# Altium project ETRX_Shield.PrjPcb (part 1 of 2)
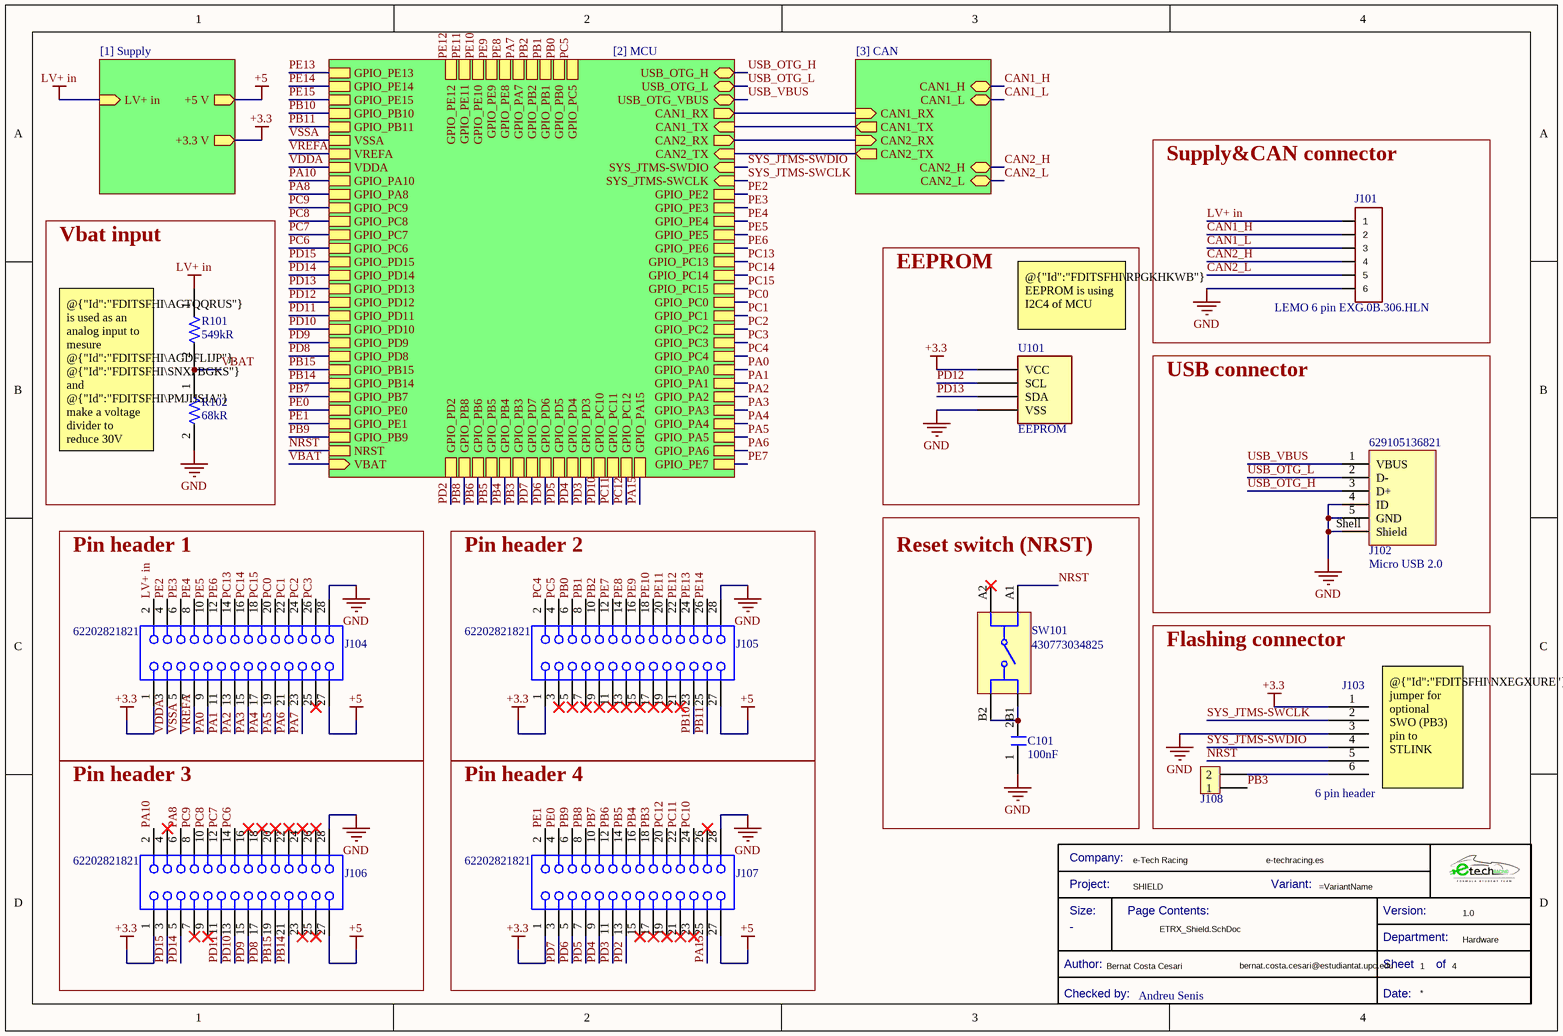
[diagram p0: ETRX_Shield.SchDoc]
Company: e-Tech Racing; Department: Hardware; DesignedByURL: e-techracing.es; DesignerMail: bernat.costa.cesari@estudiantat.upc.edu; DesignerName: Bernat Costa Cesari; Project: SHIELD; ReviewerName: Andreu Senis; Version: 1.0
4 sheets, 61 parts. Net scope: hierarchical (ports join the sheet entries above them; power ports are global).
Sheets:
  ETRX_Shield.SchDoc
    [1] Supply = [1] Supply.SchDoc
    [2] MCU = [2] MCU.SchDoc
    [3] CAN = [3] CAN.SchDoc

## Sheet ETRX_Shield.SchDoc
size A4; DocumentNumber: 1; SheetNumber: 1; SheetTotal: 4

### Parts
*  Checked by:: Andreu Senis  (hidden comment: Title Block_template)  (graphical)
C101  Capacitance: 100nF  [C1206FNPC-RW]  (hidden comment: 885012208058)
J101  LEMO 6 pin EXG.0B.306.HLN  [EXG.0B.306.HLN]
J102  629105136821  [629105136821]
J103  6 pin header
J104  62202821821  [62202821821]
J105  62202821821  [62202821821]
J106  62202821821  [62202821821]
J107  62202821821  [62202821821]
J108  282836-2  [J_screw_1x2]  (value not drawn)
R101  549kR
R102  Resistance: 68kR  [R1206FTK-W]  (hidden comment: CR1206AFX-6802EAS)
SW101  430773034825  [WS-TASV_L6W6H3.4_4307x30348xx]
U101  EEPROM

### Blocks framed on the sheet
Supply&CAN connector: J101
Vbat input: R101 R102
EEPROM: U101
USB connector: J102
Reset switch (NRST): C101 SW101
Pin header 1: J104
Pin header 2: J105
Flashing connector: J103 J108
Pin header 3: J106
Pin header 4: J107

### Sub-sheets
[1] Supply = [1] Supply: LV+ in (in), +5 V (out), +3.3 V (out)
[2] MCU = [2] MCU: CAN1_RX (out), CAN1_TX (in), CAN2_RX (out), CAN2_TX (in), USB_OTG_H (bidir), USB_OTG_L (bidir), SYS_JTMS-SWDIO (in), SYS_JTMS-SWCLK (in), GPIO_PE2, GPIO_PE3, GPIO_PE4, GPIO_PE5, GPIO_PC13, GPIO_PC14, GPIO_PC15, GPIO_PC0, GPIO_PC1, GPIO_PC2, GPIO_PC3, GPIO_PA0, GPIO_PA1, GPIO_PA2, GPIO_PA3, GPIO_PA4, GPIO_PA5, GPIO_PC4, GPIO_PC5, GPIO_PB0, GPIO_PB1, GPIO_PB2, GPIO_PE8, GPIO_PE9, GPIO_PE10, GPIO_PE11, GPIO_PE12, GPIO_PE13, GPIO_PE14, GPIO_PE15, GPIO_PB10, GPIO_PB11, VSSA, VREFA, VDDA, GPIO_PA8, GPIO_PC9, GPIO_PC8, GPIO_PC7, GPIO_PC6, GPIO_PD15, GPIO_PD14, GPIO_PD13, GPIO_PD12, GPIO_PD11, GPIO_PD10, GPIO_PD9, GPIO_PD8, GPIO_PB15, GPIO_PB14, USB_OTG_VBUS (bidir), GPIO_PB7, GPIO_PE1, GPIO_PE0, GPIO_PB9, GPIO_PB8, GPIO_PB6, GPIO_PB5, GPIO_PB4, GPIO_PB3, GPIO_PD7, GPIO_PD6, GPIO_PD5, GPIO_PD4, GPIO_PD3, GPIO_PD2, GPIO_PC12, GPIO_PC11, GPIO_PC10, GPIO_PA15, GPIO_PA10, GPIO_PE6, GPIO_PA6, GPIO_PA7, GPIO_PE7, NRST, VBAT (in)
[3] CAN = [3] CAN: CAN1_H (bidir), CAN1_L (bidir), CAN2_H (bidir), CAN2_L (bidir), CAN1_RX (in), CAN2_RX (in), CAN1_TX (out), CAN2_TX (out)

### Nets
+3.3: J103.1 J104.1 J105.1 J106.1 J107.1 U101.1(VCC) ; sheet [1] Supply/+3.3 V
+5: J104.27 J105.27 J106.27 J107.27 ; sheet [1] Supply/+5 V
GND: C101.1 J101.6 J102.4(ID) J102.5(GND) J102.Shell(Shield) J103.3 J104.28 J105.28 J106.28 J107.28 R102.2 U101.4(VSS)
LV+ in: J101.1 J104.2 R101.1 ; sheet [1] Supply/LV+ in
CAN1_H: J101.2 ; sheet [3] CAN/CAN1_H
CAN1_L: J101.3 ; sheet [3] CAN/CAN1_L
CAN1_RX: sheet [2] MCU/CAN1_RX, sheet [3] CAN/CAN1_RX
CAN1_TX: sheet [2] MCU/CAN1_TX, sheet [3] CAN/CAN1_TX
CAN2_H: J101.4 ; sheet [3] CAN/CAN2_H
CAN2_L: J101.5 ; sheet [3] CAN/CAN2_L
CAN2_RX: sheet [2] MCU/CAN2_RX, sheet [3] CAN/CAN2_RX
CAN2_TX: sheet [2] MCU/CAN2_TX, sheet [3] CAN/CAN2_TX
NRST: J103.5 SW101.A1 ; sheet [2] MCU/NRST
PA0: J104.9 ; sheet [2] MCU/GPIO_PA0
PA1: J104.11 ; sheet [2] MCU/GPIO_PA1
PA2: J104.13 ; sheet [2] MCU/GPIO_PA2
PA3: J104.15 ; sheet [2] MCU/GPIO_PA3
PA4: J104.17 ; sheet [2] MCU/GPIO_PA4
PA5: J104.19 ; sheet [2] MCU/GPIO_PA5
PA6: J104.21 ; sheet [2] MCU/GPIO_PA6
PA7: J104.23 ; sheet [2] MCU/GPIO_PA7
PA8: J106.6 ; sheet [2] MCU/GPIO_PA8
PA10: J106.2 ; sheet [2] MCU/GPIO_PA10
PA15: J107.25 ; sheet [2] MCU/GPIO_PA15
PB0: J105.6 ; sheet [2] MCU/GPIO_PB0
PB1: J105.8 ; sheet [2] MCU/GPIO_PB1
PB2: J105.10 ; sheet [2] MCU/GPIO_PB2
PB3: J107.18 J108.1 ; sheet [2] MCU/GPIO_PB3
PB4: J107.16 ; sheet [2] MCU/GPIO_PB4
PB5: J107.14 ; sheet [2] MCU/GPIO_PB5
PB6: J107.12 ; sheet [2] MCU/GPIO_PB6
PB7: J107.10 ; sheet [2] MCU/GPIO_PB7
PB8: J107.8 ; sheet [2] MCU/GPIO_PB8
PB9: J107.6 ; sheet [2] MCU/GPIO_PB9
PB10: J105.23 ; sheet [2] MCU/GPIO_PB10
PB11: J105.25 ; sheet [2] MCU/GPIO_PB11
PB14: J106.21 ; sheet [2] MCU/GPIO_PB14
PB15: J106.19 ; sheet [2] MCU/GPIO_PB15
PC0: J104.20 ; sheet [2] MCU/GPIO_PC0
PC1: J104.22 ; sheet [2] MCU/GPIO_PC1
PC2: J104.24 ; sheet [2] MCU/GPIO_PC2
PC3: J104.26 ; sheet [2] MCU/GPIO_PC3
PC4: J105.2 ; sheet [2] MCU/GPIO_PC4
PC5: J105.4 ; sheet [2] MCU/GPIO_PC5
PC6: J106.14 ; sheet [2] MCU/GPIO_PC6
PC7: J106.12 ; sheet [2] MCU/GPIO_PC7
PC8: J106.10 ; sheet [2] MCU/GPIO_PC8
PC9: J106.8 ; sheet [2] MCU/GPIO_PC9
PC10: J107.24
PC11: J107.22 ; sheet [2] MCU/GPIO_PC11
PC12: J107.20 ; sheet [2] MCU/GPIO_PC12
PC13: J104.14 ; sheet [2] MCU/GPIO_PC13
PC14: J104.16 ; sheet [2] MCU/GPIO_PC14
PC15: J104.18 ; sheet [2] MCU/GPIO_PC15
PD2: J107.13 ; sheet [2] MCU/GPIO_PD2
PD3: J107.11 ; sheet [2] MCU/GPIO_PD3
PD4: J107.9 ; sheet [2] MCU/GPIO_PD4
PD5: J107.7 ; sheet [2] MCU/GPIO_PD5
PD6: J107.5 ; sheet [2] MCU/GPIO_PD6
PD7: J107.3 ; sheet [2] MCU/GPIO_PD7
PD8: J106.17 ; sheet [2] MCU/GPIO_PD8
PD9: J106.15 ; sheet [2] MCU/GPIO_PD9
PD10: J106.13 ; sheet [2] MCU/GPIO_PD10, sheet [2] MCU/GPIO_PC10
PD11: J106.11 ; sheet [2] MCU/GPIO_PD11
PD12: U101.2(SCL) ; sheet [2] MCU/GPIO_PD12
PD13: U101.3(SDA) ; sheet [2] MCU/GPIO_PD13
PD14: J106.5 ; sheet [2] MCU/GPIO_PD14
PD15: J106.3 ; sheet [2] MCU/GPIO_PD15
PE0: J107.4 ; sheet [2] MCU/GPIO_PE0
PE1: J107.2 ; sheet [2] MCU/GPIO_PE1
PE2: J104.4 ; sheet [2] MCU/GPIO_PE2
PE3: J104.6 ; sheet [2] MCU/GPIO_PE3
PE4: J104.8 ; sheet [2] MCU/GPIO_PE4
PE5: J104.10 ; sheet [2] MCU/GPIO_PE5
PE6: J104.12 ; sheet [2] MCU/GPIO_PE6
PE7: J105.12 ; sheet [2] MCU/GPIO_PE7
PE8: J105.14 ; sheet [2] MCU/GPIO_PE8
PE9: J105.16 ; sheet [2] MCU/GPIO_PE9
PE10: J105.18 ; sheet [2] MCU/GPIO_PE10
PE11: J105.20 ; sheet [2] MCU/GPIO_PE11
PE12: J105.22 ; sheet [2] MCU/GPIO_PE12
PE13: J105.24 ; sheet [2] MCU/GPIO_PE13
PE14: J105.26 ; sheet [2] MCU/GPIO_PE14
SYS_JTMS-SWCLK: J103.2 ; sheet [2] MCU/SYS_JTMS-SWCLK
SYS_JTMS-SWDIO: J103.4 ; sheet [2] MCU/SYS_JTMS-SWDIO
USB_OTG_H: J102.3(D+) ; sheet [2] MCU/USB_OTG_H
USB_OTG_L: J102.2(D-) ; sheet [2] MCU/USB_OTG_L
USB_VBUS: J102.1(VBUS) ; sheet [2] MCU/USB_OTG_VBUS
VBAT: R101.2 R102.1 ; sheet [2] MCU/VBAT
VDDA: J104.3 ; sheet [2] MCU/VDDA
VREFA: J104.7 ; sheet [2] MCU/VREFA
VSSA: J104.5 ; sheet [2] MCU/VSSA
NetC101_2: C101.2 SW101.B1 SW101.B2
NetJ103_6: J103.6 J108.2

Not connected (* = marked no-connect by the designer): J104 25*; J105 3* 5* 7* 9* 11* 13* 15* 17* 19* 21*; J106 4* 7* 9* 16* 18* 20* 22* 23* 24* 25* 26*; J107 15* 17* 19* 21* 23* 26*; SW101 A2*

### Notes on the sheet
- (near U101) @{"Id":"FDITSFHI\RPGKHKWB"} EEPROM is using I2C4 of MCU
- @{"Id":"FDITSFHI\AGTQQRUS"} is used as an analog input to mesure @{"Id":"FDITSFHI\AGDFLIJP"}. @{"Id":"FDITSFHI\SNXPBGKS"} and @{"Id":"FDITSFHI\PMJIJSJA"} make a voltage divider to reduce 30V from @{"Id":"FDITSFHI\AGDFLIJP"} to 3.3V
- (near J102) Micro USB 2.0
- (near J103) @{"Id":"FDITSFHI\NXEGXURE"} jumper for optional SWO (PB3) pin to STLINK
- (in symbol Title Block_template) Company:; Project:; Variant:; Size:; Page Contents:; Version:; Department:; Author:; Sheet; of; Checked by:; Date:

### Library data of the parts
* = Title Block_template: Standard Title Block; .Creator: GP; Category: Title Block; .PCBcheck: GP; .SCHcheck: GP; Size: -
C101 = C100n-25V-1206FNPC-X7R: Cap Cer 0.1UF 25V X7R 1206; Manufacturer: Wurth Electronics; Tolerance: 10%; .Creator: DO; Category: Capacitor; ComponentLink1Description: Datasheet; ComponentLink1URL: https://www.we-online.com/catalog/datasheet/885012208058.pdf; ComponentLink2Description: Where buy it; ComponentLink2URL: https://www.we-online.com/catalog/en/WCAP-CSGP-25VDC#885012208058; Supplier 1: Digi-Key; Manufacturer Part Number: 885012208058; RoHS: Yes; Stock 1: 4375; Pricing 1: 1=0,11000, 10=0,10100, 100=0,09100, 500=0,08000 (USD); Mount: Surface Mount; Case/Package: 1206; Case Code (Metric): 3216; Case Code (Imperial): 1206; Min Operating Temperature: -55°C; Max Operating Temperature: 125°C; Packaging: Tape and Reel; Voltage Rating: 25V; Length: 0.126inch; Width: 0.063inch; Thickness: 0.035inch; RoHS Compliant: Yes; ComponentLink3URL: https://katalog.we-online.de/pbs/datasheet/885012208058.pdf?src-supplier=Digi-Key; ComponentLink3Description: https://katalog.we-online.de/pbs/datasheet/885012208058.pdf?src-supplier=Digi-Key; Supplier Part Number 1: 732-8109-1-ND
J101 = EXG.0B.306.HLN: MPN: EXG.0B.306.HLN; OC_FARNELL: unknown; OC_NEWARK: unknown
J102 = 629105136821: WR-COM Micro USB 2.0 SMT Type B Horizontal 5 Contacts; Manufacturer: Wurth Elektronik; Match Code: WR-USB; Gender: Receptacle; Interface Type: Type B; Number of Ports: 1; Rated Current: 1A; Working Voltage: 30V (AC); Manufacturer Part Number: 629105136821; Category: Input/Output Connectors; ComponentLink1Description: Website Link; ComponentLink1URL: https://www.we-online.com/redexpert/article/629105136821?ad; ComponentLink2Description: Datasheet Link; ComponentLink2URL: https://www.we-online.com/redexpert/spec/629105136821?ad; Mount: Surface Mount; Operating Temperature Max: 105°C; Operating Temperature Min: -40°C; Packaging: Tape and Reel; Application: Micro USB 2.0; Number of Pins: 5; Orientation: Horizontal
J104-J107 = 62202821821: WR-PHD Socket Header, THT, Vertical, pitch 1.27mm, 2 Row, 28P; Manufacturer: Wurth Elektronik; Contact Resistance: 20mΩ; Rated Current: 1A; Working Voltage: 250V; Withstanding Voltage: 500V; ComponentLink1Description: Website Link; ComponentLink1URL: https://www.we-online.com/redexpert/article/62202821821?ad; ComponentLink2Description: Datasheet Link; ComponentLink2URL: https://www.we-online.com/redexpert/spec/62202821821?ad; Manufacturer Part Number: 62202821821; Category: Board-to-Board Connectors; Match Code: WR-PHD; Mount: Through Hole; Operating Temperature Max: 105°C; Operating Temperature Min: -40°C; Packaging: Tube; Gender: Socket Header; Number of Pins: 28; Number of Rows: 2; Orientation: Vertical; Pitch: 1.27mm
J108 = J_CON2x1: Connector, Terminal Block; Wire Receptacle; 2 Pos.; 16-30 AWG; 0.197 in. CL; Sid; Manufacturer 1: TE Connectivity; Supplier 1: Arrow Electronics; Manufacturer Part Number 1: 282836-2; RoHS: Yes; Category: Terminal Blocks; Stock 1: 8391; Pricing 1: 1=0,41710, 10=0,36230, 100=0,30770, 500=0,29220, 1000=0,26130, 2500=0,23640, 5000=0,21140, 10000=0,20690, 25000=0,20320 (USD); ComponentLink1URL: https://datasheet.ciiva.com/15169/getdatasheetpartid-155855-15169553.pdf?src-supplier=Verical; ComponentLink1Description: https://datasheet.ciiva.com/15169/getdatasheetpartid-155855-15169553.pdf?src-supplier=Verical; ComponentLink2URL: https://datasheet.ciiva.com/16393/282836-2-16393382.pdf?src-supplier=Future+Electronics; ComponentLink2Description: https://datasheet.ciiva.com/16393/282836-2-16393382.pdf?src-supplier=Future+Electronics; ComponentLink3URL: https://datasheet.ciiva.com/11757/0900766b8002dc8a-11757385.pdf?src-supplier=RSComponents; ComponentLink3Description: https://datasheet.ciiva.com/11757/0900766b8002dc8a-11757385.pdf?src-supplier=RSComponents; ComponentLink4URL: https://datasheet.ciiva.com/7628/1731782-7628513.pdf?src-supplier=Element14; ComponentLink4Description: https://datasheet.ciiva.com/7628/1731782-7628513.pdf?src-supplier=Element14; ComponentLink5URL: https://datasheet.ciiva.com/823/eng-cd-282836-h10-823437.pdf?src-supplier=Digi-Key; ComponentLink5Description: https://datasheet.ciiva.com/823/eng-cd-282836-h10-823437.pdf?src-supplier=Digi-Key; ComponentLink6URL: https://datasheet.ciiva.com/3141/eng-cs-1308389-eurostyle-terminal-blocks-0607-3141118.pdf?src-supplier=Avnet; ComponentLink6Description: https://datasheet.ciiva.com/3141/eng-cs-1308389-eurostyle-terminal-blocks-0607-3141118.pdf?src-supplier=Avnet; ComponentLink7URL: https://datasheet.ciiva.com/30261/eng-cs-1308389-eurostyle-terminal-blocks-0607-30261813.pdf?src-supplier=Onlinecomponents.com; ComponentLink7Description: https://datasheet.ciiva.com/30261/eng-cs-1308389-eurostyle-terminal-blocks-0607-30261813.pdf?src-supplier=Onlinecomponents.com; Supplier Part Number 1: 282836-2
R101 = R549k - 0805
R102 = R68k-1206FTK: Resistor, AS 1206 68k1% 250mW TC100; Manufacturer: Bourns; .Creator: DO; Supplier 1: Newark; Manufacturer Part Number: CR1206AFX-6802EAS; RoHS: Yes; Category: Chip SMD Resistors; Stock 1: 4700; Pricing 1: 1=0,01100, 25=0,01100, 50=0,01100, 100=0,01100, 250=0,01100, 500=0,01100 (USD); Supplier Part Number 1: 16AH0632; ComponentLink1Description: Where buy it; ComponentLink1URL: https://www.mouser.es/ProductDetail/Bourns/CR1206AFX-6802EAS?qs=PzGy0jfpSMtMA5jyzS7M7w%3D%3D; ComponentLink2Description: Datasheet; ComponentLink2URL: https://www.mouser.es/datasheet/2/54/cr_a_as-1858644.pdf
SW101 = 430773034825: WS-TASV J-Hook SMT Hermetic Tact Switch, L6 x W6 x H3.4mm, 250g, SPST-NO, 12V, 50mA; Manufacturer: Wurth Elektronik; Washable: Yes; Manufacturer Part Number: 430773034825; Category: Tact Switches; Match Code: WS-TASV; ComponentLink1Description: Website Link; ComponentLink1URL: https://www.we-online.com/redexpert/article/430773034825?ad; ComponentLink2Description: Datasheet Link; ComponentLink2URL: https://www.we-online.com/redexpert/spec/430773034825?ad; Mount: Surface Mount; Operating Temperature Max: 85°C; Operating Temperature Min: -40°C; Packaging: Tape and Reel; Length: 6mm; Width: 6mm; Height: 3.4mm; Circuit: SPST-NO; Contact Material: Stainless Steel; Contact Plating: Silver; Operation Force: 250g; Rated Current: 50mA; Rated Voltage (DC): 12V; Terminal Material: Copper Alloy; Terminal Plating: Silver
U101 = I2C_EEPROM

## Sheet [1] Supply.SchDoc
size A4; DocumentNumber: 2; SheetNumber: 2; SheetTotal: 4
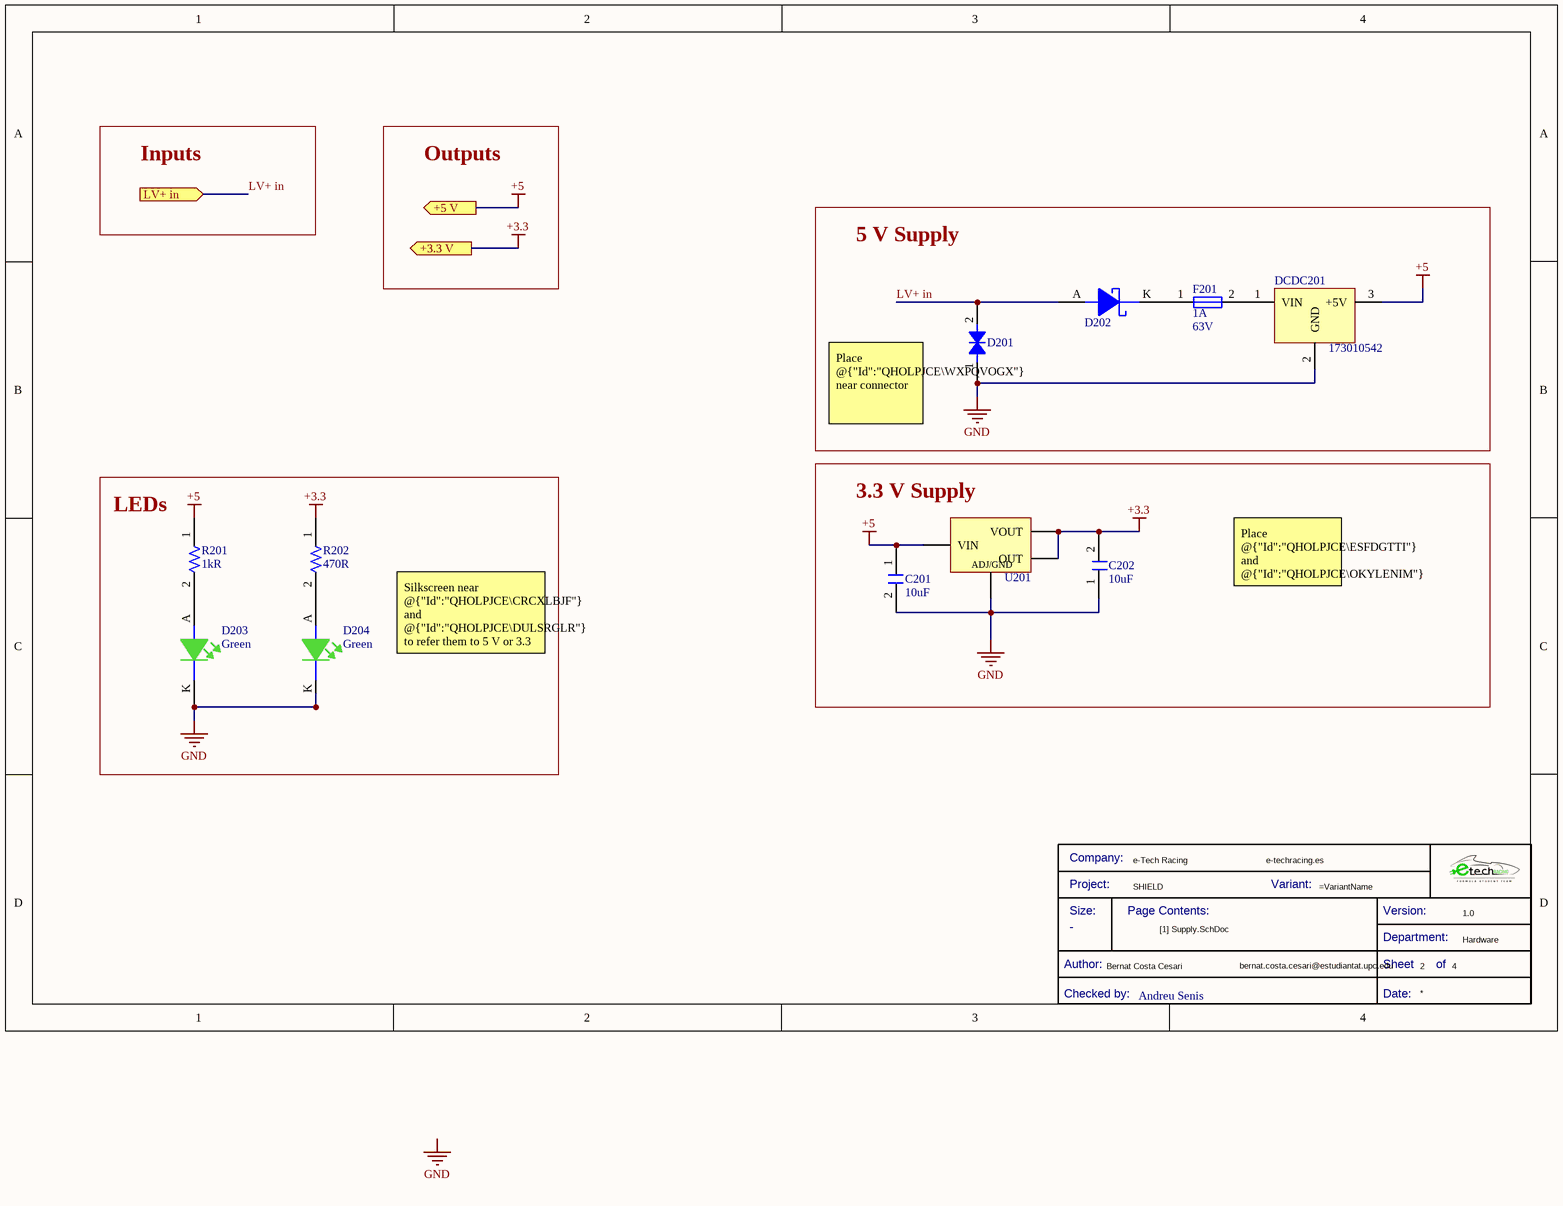
[diagram p1: [1] Supply.SchDoc]

### Parts
(Parts that share a designator on the sheet are numbered #1, #2 ... from top to bottom, then left to right.)
*?#1  Checked by:: Andreu Senis  (hidden comment: Title Block_template)  (graphical)
C201  Capacitance: 10uF  [C0805FNPC-R]  (hidden comment: 885012107014)
C202  Capacitance: 10uF  [C0805FNPC-R]  (hidden comment: 885012107014)
D201  824551301  [DTVS-DO-214AB]  (value not drawn)
D202  MBR0530  [DSC-SOD123]  (value not drawn)
D203  Color: Green  [LED_0805_WE]  (hidden comment: 150080GS75000)
D204  Color: Green  [LED_0805_WE]  (hidden comment: 150080GS75000)
DCDC201  173010542  [DCDC_Magi3c]
F201  Current Rating: 1A  Voltage Rating (DC): 63V  [Fuse_1206]  (hidden comment: 0437001.WRA)
R201  Resistance: 1kR  [R0805FTK]  (hidden comment: CR0805-JW-102ELF)
R202  Resistance: 470R  [RTO247]  (hidden comment: R470-TO247)
U201  LM1117IMP-3.3/NOPB  [LDO_10V-0.8/3V3-SOT223]  (value not drawn)

### Blocks framed on the sheet
5 V Supply: D201 D202 DCDC201 F201
LEDs: D203 D204 R201 R202
3.3 V Supply: C201 C202 U201

### Ports
+3.3 V (out), +5 V (out), LV+ in (in)

### Nets
+3.3: C202.2 R202.1 U201.2(OUT) U201.4(VOUT) ; port +3.3 V
+5: C201.1 DCDC201.3(+5V) R201.1 U201.3(VIN) ; port +5 V
GND: C201.2 C202.1 D201.1 D203.K D204.K DCDC201.2(GND) U201.1(ADJ/GND)
LV+ in: D201.2 D202.A ; port LV+ in
NetD202_K: D202.K F201.1
NetD203_A: D203.A R201.2
NetD204_A: D204.A R202.2
NetDCDC201_1: DCDC201.1(VIN) F201.2

### Notes on the sheet
- Inputs
- Outputs
- Place @{"Id":"QHOLPJCE\WXPQVOGX"} near connector
- Place @{"Id":"QHOLPJCE\ESFDGTTI"} and @{"Id":"QHOLPJCE\OKYLENIM"} near @{"Id":"QHOLPJCE\XKTUAFZT"}
- Silkscreen near @{"Id":"QHOLPJCE\CRCXLBJF"} and @{"Id":"QHOLPJCE\DULSRGLR"} to refer them to 5 V or 3.3 V
- Labels drawn without touching a wire or pin: GND
- (in symbol Title Block_template) Company:; Project:; Variant:; Size:; Page Contents:; Version:; Department:; Author:; Sheet; of; Checked by:; Date:

### Library data of the parts
*?#1 = Title Block_template: Standard Title Block; .Creator: GP; Category: Title Block; .PCBcheck: GP; .SCHcheck: GP; Size: -
C201 C202 = C10u-16V-0805FNPC-X5R: Multilayer Ceramic Capacitor, Wcap-Csgp Series, 10 F, 20%, X5R, 16 V, 0805 [2012 Metric] Rohs Compliant: Yes; Manufacturer 1: Wurth Electronics; Voltage Rating: 16V; .Creator: DR; Supplier 1: RSComponents; Manufacturer Part Number 1: 885012107014; RoHS: Yes; Category: Ceramic Capacitors; Stock 1: 81550; Pricing 1: 50=0,21000, 250=0,20200, 500=0,19100, 1000=0,17400, 2500=0,14700 (GBP); Mount: Surface Mount; Case/Package: 0805; Case Code (Metric): 2012; Case Code (Imperial): 0805; Min Operating Temperature: -55°C; Max Operating Temperature: 85°C; Packaging: Cut Tape; Dielectric: X5R; Tolerance: 20%; Voltage Rating (DC): 16V; Length: 0.079inch; Width: 0.049inch; Thickness: 0.057inch; REACH SVHC: Unknown; RoHS Compliant: Yes; ComponentLink1URL: http://www.farnell.com/datasheets/1958454.pdf?src-supplier=Farnell; ComponentLink1Description: http://www.farnell.com/datasheets/1958454.pdf?src-supplier=Farnell; ComponentLink2URL: http://www.farnell.com/datasheets/1958454.pdf?src-supplier=Element14; ComponentLink2Description: http://www.farnell.com/datasheets/1958454.pdf?src-supplier=Element14; ComponentLink3URL: https://katalog.we-online.de/pbs/datasheet/885012107014.pdf?src-supplier=Digi-Key; ComponentLink3Description: https://katalog.we-online.de/pbs/datasheet/885012107014.pdf?src-supplier=Digi-Key; ComponentLink4URL: http://www.farnell.com/datasheets/1958454.pdf?src-supplier=Newark; ComponentLink4Description: http://www.farnell.com/datasheets/1958454.pdf?src-supplier=Newark; Supplier Part Number 1: 1813526
D201 = DTVS-40V-DO-214AB: TVS diode [Würth Elektronik] 824551301 TVS diode; Manufacturer: Wurth Electronics; Number of Bidirectional Channels: 1; Reverse Standoff Voltage: 30V; Min Breakdown Voltage: 35.05V; Clamping Voltage: 48.4V; Peak Pulse Power: 3kW; Power Line Protection: No; Polarity: Bidirectional; Peak Pulse Current: 62A; .Creator: DO; ComponentLink2Description: Where buy it; ComponentLink2URL: https://www.we-online.com/catalog/en/WE-TVSP?sq=824551301#824551301; Supplier 1: RSComponents; Manufacturer Part Number: 824551301; RoHS: Yes; Category: TVS Diodes; Stock 1: 1; Pricing 1: 10=1,72500, 50=1,54700, 100=1,45300, 250=1,35100, 500=1,15000 (USD); Mount: Surface Mount; Number of Pins: 2; Min Operating Temperature: -65°C; Max Operating Temperature: 150°C; Packaging: Cut Tape; Max Breakdown Voltage: 35.05V; Resistor Type: Zener; REACH SVHC: Unknown; RoHS Compliant: Yes; ComponentLink1URL: http://www.farnell.com/datasheets/2036459.pdf?src-supplier=Element14; ComponentLink1Description: http://www.farnell.com/datasheets/2036459.pdf?src-supplier=Element14; Supplier Part Number 1: 9217092P
D202 = DSC-0.5/30-SOD123: VR=30V IF=500mA 30pF P=410mW; Element Configuration: Single; Forward Voltage: 430mV; Peak Non-Repetitive Surge Current: 5.5A; Average Rectified Current: 500mA; Max Reverse Leakage Current: 130uA; Max Reverse Voltage (DC): 30V; Polarity: Standard; .Creator: GP; Category: Diode; ComponentLink1Description: Datasheet; ComponentLink1URL: *; ComponentLink2Description: Where buy it; ComponentLink2URL: *; Supplier 1: Newark; Stock 1: 9; Pricing 1: 1=0,34400, 10=0,23900, 100=0,12200, 500=0,10000 (USD); Mount: Surface Mount; Contact Plating: Tin,Matte; Weight: 0.03g; Package Quantity: 1; Max Surge Current: 5.5A; Forward Current: 500mA; Max Reverse Current: 130uA; Max Repetitive Reverse Voltage (Vrrm): 30V; Max Forward Surge Current (Ifsm): 5.5A; Voltage Rating (DC): 30V; Current Rating: 500mA; Output Current: 500mA; Series: -; Length: 2.7mm; Width: 1.6mm; Height: 1.03mm; Radiation Hardening: No; RoHS Compliant: Yes; REACH SVHC: No SVHC; Lead Free: Lead Free; ComponentLink3URL: https://datasheet.ciiva.com/30479/0900766b810e2512-30479401.pdf?src-supplier=RSComponents; ComponentLink3Description: https://datasheet.ciiva.com/30479/0900766b810e2512-30479401.pdf?src-supplier=RSComponents; ComponentLink4URL: https://datasheet.ciiva.com/34301/974753-34301826.pdf?src-supplier=Jameco; ComponentLink4Description: https://datasheet.ciiva.com/34301/974753-34301826.pdf?src-supplier=Jameco; ComponentLink5URL: https://datasheet.ciiva.com/910/mbr0530-910516.pdf?src-supplier=Digi-Key; ComponentLink5Description: https://datasheet.ciiva.com/910/mbr0530-910516.pdf?src-supplier=Digi-Key; ComponentLink6URL: https://datasheet.ciiva.com/25931/mbr0530-25931989.pdf?src-supplier=Avnet+Europe; ComponentLink6Description: https://datasheet.ciiva.com/25931/mbr0530-25931989.pdf?src-supplier=Avnet+Europe; ComponentLink7URL: https://datasheet.ciiva.com/8300/mbr0530-8300905.pdf?src-supplier=Avnet; ComponentLink7Description: https://datasheet.ciiva.com/8300/mbr0530-8300905.pdf?src-supplier=Avnet; ComponentLink8URL: https://datasheet.ciiva.com/17318/mbr0530-17318568.pdf?src-supplier=Future+Electronics; ComponentLink8Description: https://datasheet.ciiva.com/17318/mbr0530-17318568.pdf?src-supplier=Future+Electronics; ComponentLink9URL: https://datasheet.ciiva.com/15144/getdatasheetpartid-86760-15144598.pdf?src-supplier=Verical; ComponentLink9Description: https://datasheet.ciiva.com/15144/getdatasheetpartid-86760-15144598.pdf?src-supplier=Verical; ComponentLink10URL: https://datasheet.ciiva.com/910/mbr0530-910518.pdf?src-supplier=Digi-Key; ComponentLink10Description: https://datasheet.ciiva.com/910/mbr0530-910518.pdf?src-supplier=Digi-Key; Supplier Part Number 1: 15R3453
D203 D204 = LEDGS-0805-450: Led, Green, 520 Nm, 3.2 V, 30 Ma, 450 Mcd Rohs Compliant: Yes; Manufacturer 1: Wurth Electronics; Viewing Angle: 140°; Lens Style: Clear,Rectangular; Luminous Intensity: 450mcd; Forward Voltage: 3.2V; Wavelength: 520nm; Forward Current: 30mA; Test Current: 20mA; .Creator: GP; ComponentLink1Description: Datasheet; ComponentLink1URL: https://www.we-online.com/catalog/datasheet/150080GS75000.pdf; ComponentLink2Description: Where buy it; ComponentLink2URL: https://katalog.we-online.de/en/led/WL-SMCW/150080GS75000; Supplier 1: RSComponents; Manufacturer Part Number 1: 150080GS75000; RoHS: Yes; Category: LEDs; Stock 1: 4350; Pricing 1: 50=0,19300, 500=0,12900, 1000=0,12300, 2000=0,11700, 4000=0,11100 (USD); Mount: Surface Mount; Case/Package: 0805; Case Code (Metric): 2012; Case Code (Imperial): 0805; Min Operating Temperature: -40°C; Max Operating Temperature: 85°C; Package Quantity: 4000; Packaging: Cut Tape; Dominant Wavelength: 520nm; Length: 2mm; Width: 1.25mm; Height: 0.7mm; REACH SVHC: Unknown; RoHS Compliant: Yes; ComponentLink3URL: https://datasheet.ciiva.com/29563/150080gs75000-29563008.pdf?src-supplier=Digi-Key; ComponentLink3Description: https://datasheet.ciiva.com/29563/150080gs75000-29563008.pdf?src-supplier=Digi-Key; ComponentLink4URL: https://datasheet.ciiva.com/29279/759434-da-01-en-chipled-0805-w-kl-gruen-150080gs75000-29279039.pdf?src-supplier=Conrad; ComponentLink4Description: https://datasheet.ciiva.com/29279/759434-da-01-en-chipled-0805-w-kl-gruen-150080gs75000-29279039.pdf?src-supplier=Conrad; Supplier Part Number 1: 8154221
DCDC201 = DCDC-42V/5V-1A: Würth Elektronik 8-42V to 5V 1A DC-DC; Manufacturer 1: Wurth Electronics; Number of Outputs: 1; Min Input Voltage: 8V; Max Input Voltage: 42V; Efficiency: 93%; .Creator: DR; Supplier 1: RSComponents; Manufacturer Part Number 1: 173010542; RoHS: Yes; Stock 1: 1; Pricing 1: 1=12,22500, 8=10,96900, 21=10,68900 (USD); Mount: Through Hole; Min Operating Temperature: -40°C; Max Operating Temperature: 85°C; Features: UVLO,OCP,OTP,SCP; Packaging: Rail/Tube; Voltage - Output 1: 5V; Max Output Current: 1A; RoHS Compliant: Yes; ComponentLink1URL: http://www.farnell.com/datasheets/2192895.pdf?src-supplier=Farnell; ComponentLink1Description: http://www.farnell.com/datasheets/2192895.pdf?src-supplier=Farnell; ComponentLink2URL: http://www.farnell.com/datasheets/2192895.pdf?src-supplier=Newark; ComponentLink2Description: http://www.farnell.com/datasheets/2192895.pdf?src-supplier=Newark; ComponentLink3URL: https://katalog.we-online.de/pm/datasheet/173010542.pdf?src-supplier=Digi-Key; ComponentLink3Description: https://katalog.we-online.de/pm/datasheet/173010542.pdf?src-supplier=Digi-Key; Supplier Part Number 1: 1447809
F201 = Fuse_1A_63V_1206: Fuse Chip Fast Acting 1A 63V SMD Solder Pad 1206 Ceramic T/R Automotive; Manufacturer: Littelfuse; Fuse Type: Board Mount (Cartridge Style Excluded); Approvals: CSA,cURus; .Creator: DO; Supplier 1: Digi-Key; Manufacturer Part Number: 0437001.WRA; RoHS: Yes; Category: Fuses; Stock 1: 5820; Pricing 1: 1=1,52000, 5=1,47000, 10=1,37600, 50=1,13860, 100=0,94880, 250=0,92508, 500=0,78276, 1000=0,68788 (USD); Mount: Surface Mount; Case/Package: 1206; Case Code (Imperial): 1206; Case Code (Metric): 3216; Min Operating Temperature: -55°C; Max Operating Temperature: 150°C; Packaging: Tape and Reel; Voltage Rating (AC): 63V; ComponentLink1URL: https://www.littelfuse.com/~/media/electronics/datasheets/fuses/littelfuse_fuse_437a_datasheet.pdf.pdf?src-supplier=Digi-Key; ComponentLink1Description: https://www.littelfuse.com/~/media/electronics/datasheets/fuses/littelfuse_fuse_437a_datasheet.pdf.pdf?src-supplier=Digi-Key; Supplier Part Number 1: F10001CT-ND; ComponentLink2Description: Where buy it; ComponentLink2URL: https://www.mouser.es/ProductDetail/Littelfuse/0437001WRA?qs=DXv0QSHKF4z9CJhPXjxR%252BA%3D%3D
R201 = R1k-0805FTK: Res Thick Film 0805 1K Ohm 5% 1/8W ±200ppm/°C Molded SMD SMD Paper Tape on Plastic Reel; Manufacturer 1: Bourns; Voltage Rating (DC): 150V; Power Rating: 125mW; .Creator: GP; Supplier 1: Arrow Electronics; Manufacturer Part Number 1: CR0805-JW-102ELF; RoHS: Yes; Category: Chip SMD Resistors; Stock 1: 27510; Pricing 1: 1=0,05930, 10=0,03510, 25=0,01790, 100=0,00800, 250=0,00790, 500=0,00590, 1000=0,00360, 3000=0,00350, 6000=0,00250 (USD); Mount: Surface Mount; Case/Package: 0805; Number of Pins: 2; Contact Plating: Tin; Case Code (Metric): 2012; Case Code (Imperial): 0805; Min Operating Temperature: -55°C; Max Operating Temperature: 155°C; Resistor Type: Thick Film; Tolerance: 5%; Temperature Coefficient: 200ppm/°C; Features: Moisture Resistant; Package Quantity: 1; Packaging: Tape and Reel; Voltage Rating: 150V; Number of Terminations: 2; Termination: SMD/SMT; Max Power Dissipation: 125mW; Length: 2mm; Width: 1.25mm; Height: 0.5mm; Thickness: 508um; Depth: 1.25mm; Radiation Hardening: No; Lead Free: Lead Free; REACH SVHC: No SVHC; Military Standard: Not; ComponentLink1URL: https://datasheet.ciiva.com/11821/0900766b80fcdb72-11821134.pdf?src-supplier=RSComponents; ComponentLink1Description: https://datasheet.ciiva.com/11821/0900766b80fcdb72-11821134.pdf?src-supplier=RSComponents; ComponentLink2URL: https://datasheet.ciiva.com/15225/getdatasheetpartid-78155-15225381.pdf?src-supplier=Verical; ComponentLink2Description: https://datasheet.ciiva.com/15225/getdatasheetpartid-78155-15225381.pdf?src-supplier=Verical; ComponentLink3URL: https://datasheet.ciiva.com/22693/1902866-22693253.pdf?src-supplier=Element14; ComponentLink3Description: https://datasheet.ciiva.com/22693/1902866-22693253.pdf?src-supplier=Element14; ComponentLink4URL: https://datasheet.ciiva.com/7986/1856384-7986184.pdf?src-supplier=Element14; ComponentLink4Description: https://datasheet.ciiva.com/7986/1856384-7986184.pdf?src-supplier=Element14; ComponentLink5URL: https://datasheet.ciiva.com/7985/1856384-7985867.pdf?src-supplier=Element14; ComponentLink5Description: https://datasheet.ciiva.com/7985/1856384-7985867.pdf?src-supplier=Element14; ComponentLink6URL: https://datasheet.ciiva.com/30242/159chpreztr-30242765.pdf?src-supplier=Onlinecomponents.com; ComponentLink6Description: https://datasheet.ciiva.com/30242/159chpreztr-30242765.pdf?src-supplier=Onlinecomponents.com; ComponentLink7URL: https://datasheet.ciiva.com/6547/chpreztr-6547359.pdf?src-supplier=Digi-Key; ComponentLink7Description: https://datasheet.ciiva.com/6547/chpreztr-6547359.pdf?src-supplier=Digi-Key; Supplier Part Number 1: CR0805-JW-102ELF
R202 = R470-TO247: Manufacturer: TE Connectivity; Manufacturer Part Number: MPT100C470RF; Supplier 1: RSComponents; RoHS: No; Stock 1: 67; Pricing 1: 1=16,67000, 5=15,51000, 10=14,17000, 25=12,67000, 50=11,50000 (GBP); Supplier Part Number 1: 1955176; ComponentLink1Description: Buy; ComponentLink1URL: https://es.rs-online.com/web/p/resistencias-de-montaje-en-orificio-pasante/1955176; ComponentLink2Description: Datasheet; ComponentLink2URL: https://docs.rs-online.com/e31c/A700000006565355.pdf
U201 = LDO_10V-0.8/3V3-SOT223: LDO Regulator Pos 3.3V 0.8A 4-Pin(3+Tab) SOT-223 T/R / IC REG LDO 3.3V 0.8A SOT223; Manufacturer: Texas Instruments; Number of Outputs: 1; Max Input Voltage: 15V; Max Output Current: 800mA; Polarity: Positive; Quiescent Current: 15mA; Accuracy: 1%; Output Type: Fixed; Dropout Voltage: 1.2V; Min Input Voltage: 2.6V; Max Supply Voltage: 10V; Min Supply Voltage: 4.75V; Current Rating: 800A; .Creator: GP; ComponentLink1URL: https://www.ti.com/lit/ds/symlink/lm1117.pdf?HQS=dis-mous-null-mousermode-dsf-pf-null-wwe&DCM=yes&ref_url=https%3A%2F%2Fwww.mouser.de%2F&distId=26; ComponentLink1Description: Datasheet; ComponentLink2Description: Where buy it; ComponentLink2URL: https://www.mouser.es/ProductDetail/Texas-Instruments/LM1117IMP-33-NOPB?qs=X1J7HmVL2ZFbpN1TgOsjYQ%3D%3D; Supplier 1: Digi-Key; Manufacturer Part Number: LM1117IMP-3.3/NOPB; RoHS: Yes; Category: LDO; Pricing 1: 1=1,41000, 10=1,26300, 25=1,19920, 100=0,98500, 250=0,92072, 500=0,81366 (USD); Mount: Surface Mount; Case/Package: SOT-223; Number of Pins: 4; Min Operating Temperature: -40°C; Max Operating Temperature: 125°C; Output Voltage: 3.3V; Packaging: Tape and Reel; Output Current: 800mA; Nominal Output Voltage: 3.3V; Termination: SMD/SMT; Output Voltage Accuracy: 1%; Number of Regulators: 1; Min Current Limit: 800mA; Package Quantity: 1000; Length: 6.5mm; Width: 3.56mm; Height: 1.6mm; Radiation Hardening: No; REACH SVHC: No SVHC; Lead Free: Lead Free; RoHS Compliant: Yes; ComponentLink3URL: https://datasheet.ciiva.com/27051/1281318-27051810.pdf?src-supplier=Jameco; ComponentLink3Description: https://datasheet.ciiva.com/27051/1281318-27051810.pdf?src-supplier=Jameco; ComponentLink4URL: https://datasheet.ciiva.com/8042/1670636-8042261.pdf?src-supplier=Element14; ComponentLink4Description: https://datasheet.ciiva.com/8042/1670636-8042261.pdf?src-supplier=Element14; ComponentLink5URL: https://datasheet.ciiva.com/1570/1849796-1570171.pdf?src-supplier=Farnell; ComponentLink5Description: https://datasheet.ciiva.com/1570/1849796-1570171.pdf?src-supplier=Farnell; ComponentLink6URL: https://datasheet.ciiva.com/14149/lm1117-eng-tds-14149980.pdf?src-supplier=Distrelec; ComponentLink6Description: https://datasheet.ciiva.com/14149/lm1117-eng-tds-14149980.pdf?src-supplier=Distrelec; ComponentLink7URL: https://datasheet.ciiva.com/46386/1882372-46386042.pdf?src-supplier=Element14; ComponentLink7Description: https://datasheet.ciiva.com/46386/1882372-46386042.pdf?src-supplier=Element14; ComponentLink8URL: https://datasheet.ciiva.com/3223/lm1117-n-3223515.pdf?src-supplier=Avnet; ComponentLink8Description: https://datasheet.ciiva.com/3223/lm1117-n-3223515.pdf?src-supplier=Avnet; ComponentLink9URL: https://datasheet.ciiva.com/6580/lm1117-n-6580030.pdf?src-supplier=Digi-Key; ComponentLink9Description: https://datasheet.ciiva.com/6580/lm1117-n-6580030.pdf?src-supplier=Digi-Key; ComponentLink10URL: https://datasheet.ciiva.com/6580/lm1117-n-6580026.pdf?src-supplier=Digi-Key; ComponentLink10Description: https://datasheet.ciiva.com/6580/lm1117-n-6580026.pdf?src-supplier=Digi-Key; Supplier Part Number 1: LM1117IMP-3.3/NOPBCT-ND